# Altium schematic sheet Boost.SchDoc
size A
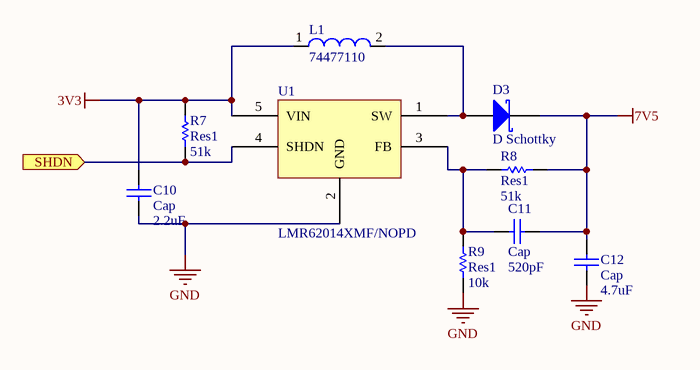
[diagram p0: Boost.SchDoc]

## Parts
C10  Cap  value 2.2uF  [1608[0603]]
C11  Cap  value 520pF  [6-0805_N]
C12  Cap  value 4.7uF  [6-0805_N]
D3  D Schottky  [CDBA5]
L1  74477110  [WE-PD-L]
R7  Res1  value 51k  [1608[0603]]
R8  Res1  value 51k  [1608[0603]]
R9  Res1  value 10k  [0402-A]
U1  LMR62014XMF/NOPD  [SOT95P280X145-5N]

## Ports
SHDN (in)

## Nets
3V3: C10.2 L1.1 R7.1 U1.5(VIN)
7V5: C11.1 C12.2 D3.2(K) R8.2
GND: C10.1 C12.1 R9.2 U1.2(GND)
SHDN: R7.2 U1.4(SHDN) ; port SHDN
NetC11_2: C11.2 R8.1 R9.1 U1.3(FB)
NetD3_1: D3.1(A) L1.2 U1.1(SW)

## Library data of the parts
C10-C12 = Cap: Capacitor; Published: 8-Jun-2000; LatestRevisionDate: 17-Jul-2002; LatestRevisionNote: Re-released for DXP Platform.; PackageReference: RAD-0.3; Publisher: Altium Limited; PackageDescription: Radial Cap, Thru-Hole; 2 Leads; 0.3 in Pin Spacing
D3 = D Schottky: Schottky Diode; Published: 8-Jun-2000; LatestRevisionDate: 17-Jul-2002; LatestRevisionNote: Re-released for DXP Platform.; PackageReference: SMB; Publisher: Altium Limited; PackageDescription: DO-214-AA/SMB; 2 C-Bend Leads; Body 5.3 x 3.6 mm, inc. leads (LxW); Code_JEDEC: DO-214-AA
L1 = CMP-0227-00708-1: SMD-Shielded Power Inductor WE-PD, L = 10.0 µH; Inductance: 10.0 ÂµH; ComponentLink2Description: Datasheet; DatasheetVersion: ver 7, Sep-2006; PackageVersion: 2006; ComponentLink1URL: http://www.we-online.com; ComponentLink1Description: Manufacturer Link; ComponentLink2URL: http://www.we-online.de/katalog/media/pdf/74477110.pdf; PackageDescription: SMD Inductor, 2-Leads, Body 12.0 x 12.0 mm; PackageReference: WE-PD-L
R7-R9 = Res1: Resistor; Published: 8-Jun-2000; LatestRevisionDate: 17-Jul-2002; LatestRevisionNote: Re-released for DXP Platform.; PackageReference: AXIAL-0.3; Publisher: Altium Limited; PackageDescription: Axial Device, Thru-Hole; 2 Leads; 0.3 in Pin Spacing